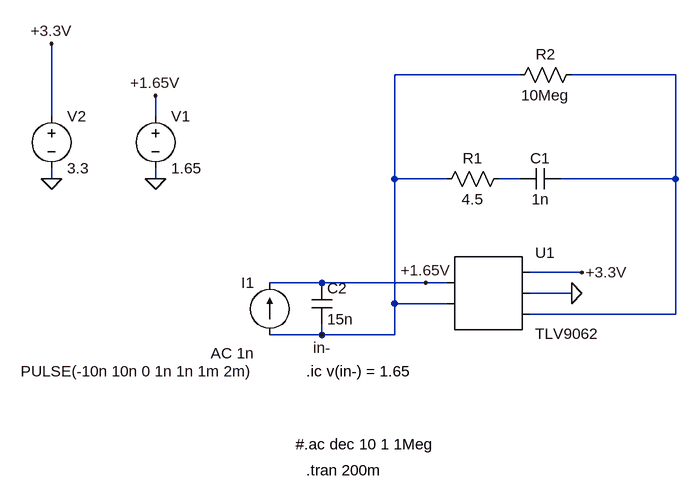
[diagram p0: schematic charge_amplifier.asc]
charge_amplifier.asc, the LTspice schematic file:
Version 4
SHEET 1 880 680
WIRE 176 -80 -16 -80
WIRE 416 -80 256 -80
WIRE -544 -16 -544 -128
WIRE -384 -16 -384 -48
WIRE -544 80 -544 64
WIRE -384 80 -384 64
WIRE -16 80 -16 -80
WIRE 64 80 -16 80
WIRE 176 80 144 80
WIRE 416 80 416 -80
WIRE 416 80 240 80
WIRE 272 224 192 224
WIRE -128 240 -208 240
WIRE 32 240 -128 240
WIRE 64 240 32 240
WIRE 256 256 192 256
WIRE -16 272 -16 80
WIRE 64 272 -16 272
WIRE 416 288 416 80
WIRE 416 288 192 288
WIRE -128 320 -128 304
WIRE -128 320 -208 320
WIRE -16 320 -16 272
WIRE -16 320 -128 320
FLAG -544 80 0
FLAG -384 80 0
FLAG 256 256 0
FLAG -544 -128 +3.3V
FLAG -384 -48 +1.65V
FLAG 272 224 +3.3V
FLAG 32 240 +1.65V
FLAG -128 320 in-
SYMBOL cap 240 64 R90
WINDOW 0 0 32 VBottom 2
WINDOW 3 32 32 VTop 2
SYMATTR InstName C1
SYMATTR Value 1n
SYMBOL res 160 64 R90
WINDOW 0 0 56 VBottom 2
WINDOW 3 32 56 VTop 2
SYMATTR InstName R1
SYMATTR Value 4.5
SYMBOL res 272 -96 R90
WINDOW 0 0 56 VBottom 2
WINDOW 3 32 56 VTop 2
SYMATTR InstName R2
SYMATTR Value 10Meg
SYMBOL current -208 320 R180
WINDOW 0 24 80 Left 2
WINDOW 3 24 -56 Left 2
WINDOW 123 24 -28 Left 2
WINDOW 39 0 0 Left 0
SYMATTR InstName I1
SYMATTR Value PULSE(-10n 10n 0 1n 1n 1m 2m)
SYMATTR Value2 AC 1n
SYMBOL cap -144 240 R0
SYMATTR InstName C2
SYMATTR Value 15n
SYMBOL AutoGenerated\\TLV9062 128 256 R0
SYMATTR InstName U1
SYMBOL voltage -384 -32 R0
WINDOW 123 0 0 Left 0
WINDOW 39 0 0 Left 0
SYMATTR InstName V1
SYMATTR Value 1.65
SYMBOL voltage -544 -32 R0
WINDOW 123 0 0 Left 0
WINDOW 39 0 0 Left 0
SYMATTR InstName V2
SYMATTR Value 3.3
TEXT -168 488 Left 2 !#.ac dec 10 1 1Meg
TEXT -152 528 Left 2 !.tran 200m
TEXT -152 376 Left 2 !.ic v(in-) = 1.65

The netlist it stands for:
* charge_amplifier.asc
C1 N001 N002 1n
R1 N002 in- 4.5
R2 N001 in- 10Meg
I1 in- +1.65V PULSE(-10n 10n 0 1n 1n 1m 2m) AC 1n
C2 +1.65V in- 15n
* U1: TLV9062 (symbol AutoGenerated\TLV9062 not available, pins judged from their places): pin1=+1.65V pin2=in- pin3=+3.3V pin4=0 pin5=N001
V1 +1.65V 0 1.65
V2 +3.3V 0 3.3
#.ac dec 10 1 1Meg
.tran 200m
.ic v(in-) = 1.65
.backanno
.end